# Altium project um3Supply.PrjPcb
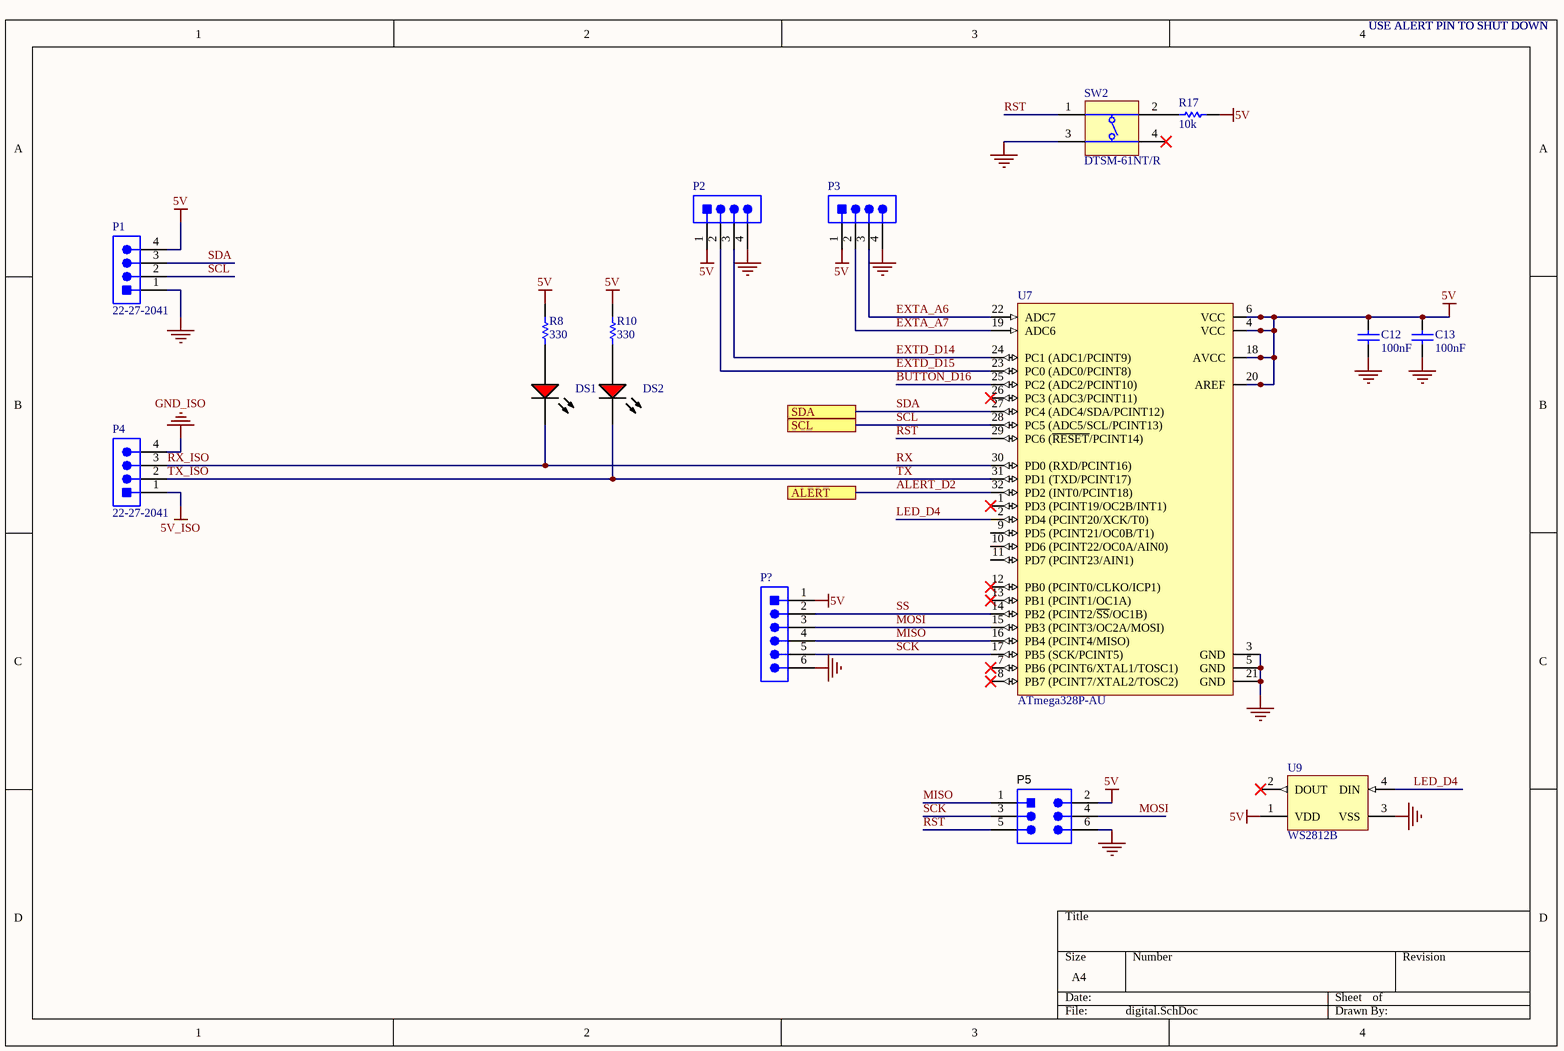
[diagram p0: digital.SchDoc]
2 sheets, 50 parts. Net scope: flat (ports and power ports of the same name join across sheets).
Sheets:
  digital.SchDoc
  um3Supply.SchDoc

## Sheet digital.SchDoc
size A4

### Parts
C12  100nF  [CAPC0805(2012)100_L]
C13  100nF  [CAPC0805(2012)100_L]
DS1  TLMS1100-GS08  [VISH-TLMX1100_V]  (value not drawn)
DS2  TLMS1100-GS08  [VISH-TLMX1100_V]  (value not drawn)
P1  22-27-2041  [MOLX-22-27-2041_V]
P2  22-27-2041  [MOLX-22-27-2041_V]  (value not drawn)
P3  22-27-2041  [MOLX-22-27-2041_V]  (value not drawn)
P4  22-27-2041  [MOLX-22-27-2041_V]
P5  5-146130-2  [TECO-5-146130-2_V]  (value not drawn)
P?  22-23-2061  [MOLX-22-23-2061_V]  (value not drawn)
R8  330  [RESC0805(2012)_L]
R10  330  [RESC0805(2012)_L]
R17  10k  [RESC0805(2012)_L]
SW2  DTSM-61NT/R  [DIPT-DTSM-6_V]
U7  ATmega328P-AU  [32A_M]
U9  WS2812B  [ADAI-WS2812B_V]

### Ports
ALERT, SCL, SDA

### Nets
5V: C12.2 C13.2 P1.4 P2.1 P3.1 P5.2 P?.1 R8.1 R10.1 R17.2 U7.4(VCC) U7.6(VCC) U7.18(AVCC) U7.20(AREF) U9.1(VDD)
5V_ISO: P4.1
GND: C12.1 C13.1 P1.1 P2.4 P3.4 P5.6 P?.6 SW2.3(T3) U7.3(GND) U7.5(GND) U7.21(GND) U9.3(VSS)
GND_ISO: P4.4
ALERT_D2: U7.32(PD2_(INT0/PCINT18)) ; port ALERT
BUTTON_D16: U7.25(PC2_(ADC2/PCINT10))
EXTA_A6: P3.3 U7.22(ADC7)
EXTA_A7: P3.2 U7.19(ADC6)
EXTD_D14: P2.3 U7.24(PC1_(ADC1/PCINT9))
EXTD_D15: P2.2 U7.23(PC0_(ADC0/PCINT8))
LED_D4: U7.2(PD4_(PCINT20/XCK/T0)) U9.4(DIN)
MISO: P5.1 P?.4 U7.16(PB4_(PCINT4/MISO))
MOSI: P5.4 P?.3 U7.15(PB3_(PCINT3/OC2A/MOSI))
RST: P5.5 SW2.1(T1) U7.29(PC6_(~{RESET}/PCINT14))
RX: DS1.2(K) P4.3 U7.30(PD0_(RXD/PCINT16))  [also labelled RX_ISO]
SCK: P5.3 P?.5 U7.17(PB5_(SCK/PCINT5))
SCL: P1.2 U7.28(PC5_(ADC5/SCL/PCINT13)) ; port SCL
SDA: P1.3 U7.27(PC4_(ADC4/SDA/PCINT12)) ; port SDA
SS: P?.2 U7.14(PB2_(PCINT2/~{SS}/OC1B))
TX: DS2.2(K) P4.2 U7.31(PD1_(TXD/PCINT17))  [also labelled TX_ISO]
NetDS1_1: DS1.1(A) R8.2
NetDS2_1: DS2.1(A) R10.2
NetR17_1: R17.1 SW2.2(T2)

Not connected (* = marked no-connect by the designer): SW2 4(T3)*; U7 1(PD3_(PCINT19/OC2B/INT1))* 7(PB6_(PCINT6/XTAL1/TOSC1))* 8(PB7_(PCINT7/XTAL2/TOSC2))* 9(PD5_(PCINT21/OC0B/T1)) 10(PD6_(PCINT22/OC0A/AIN0)) 11(PD7_(PCINT23/AIN1)) 12(PB0_(PCINT0/CLKO/ICP1))* 13(PB1_(PCINT1/OC1A))* 26(PC3_(ADC3/PCINT11))*; U9 2(DOUT)*

### Notes on the sheet
- USE ALERT PIN TO SHUT DOWN

### Library data of the parts
C12 C13 = CMP-1036-04734-1: Tolerance: Â±20%; Case-Metric: 2012; Rated Voltage: 6.3 V; Value: 1uF; Case-EIA: 0805; Max Thickness: 1 mm; Technology: SMT
DS1 DS2 = CMP-1666-00027-1: LED, RED, 2.1 V, -40 to 100 degC, 2-Pin SMD (0603), RoHS, Tape and Reel; Type (Capacitors): C0G; Resistance: 100000000000 Ohm; Capacitance: 12 pF; Voltage Rating: 50 V; Tolerance: 5%; Min Operating Temperature: -55degC; REACH SVHC: No SVHC; ComponentLink2Description: Datasheet; ComponentLink1URL: http://www.vishay.com/; Width: 0.8 mm; Package Quantity: 4000; PackageReference: TLMX1100; ComponentLink2URL: http://www.vishay.com/docs/83173/tlmb1100.pdf; Case/Package: 0603; Case Code (Metric): 1608; Packaging: Tape and Reel; Pins: 2; ComponentLink1Description: Manufacturer URL; Max Operating Temperature: 125degC; Height: 0.8 mm; Length: 1.6 mm; Mount: Surface Mount; PackageDescription: 2-Pin Surface Mount Device, Body 1.6 x 0.8 mm; DatasheetVersion: Rev. 2.7, 03/2016; Case Code (Imperial): 0603; Voltage Rating (DC): 50 V; RoHSCompliant: True; Radiation Hardening: No
P1-P4 = CMP-2000-05243-1: Male Header, Pitch 2.54 mm, 1 x 4 Position, Height 11.7 mm, Tail Length 3.56 mm, RoHS, Bulk; Manufacturer: Molex; Voltage rating: 250V; Current rating: 4A; Datasheet Version: Rev. F, 06/2009; Operating temperature: 0degCto+75degC; Contact material: Tinplatedbrass; Manufacturer URL: http://www.molex.com/; Housing material: Nylon(UL94V-0); Datasheet URL: http://www.molex.com/pdm_docs/sd/022272041_sd.pdf
P5 = CMP-1684-00011-1: Male Header, Pitch 2.54 mm, 2 x 3 Position, Height 8.13 mm, -65 to 125 degC, RoHS, Tube; Max Supply Voltage: 5.5 V; Min Supply Voltage: 4.5 V; Nominal Supply Voltage: 5 V; Min Operating Temperature: -40 degC; ComponentLink1URL: http://www.te.com/; ComponentLink2Description: Datasheet; Pins: 3; Max Operating Temperature: 150 degC; PackageDescription: Male Header, Pitch 2.54 mm, 2 x 3 Position, Height 8.13 mm; Package Quantity: 3000; PackageReference: 5-146130-2; DatasheetVersion: Oct-15; ComponentLink1Description: Manufacturer URL; Radiation Hardening: No; Mount: Surface Mount; RoHSCompliant: true; Packaging: Tape and Reel; ComponentLink2URL: http://www.te.com/commerce/DocumentDelivery/DDEController?Action=showdoc&DocId=Customer+Drawing%7F146130%7FM%7Fpdf%7FEnglish%7FENG_CD_146130_M.pdf%7F5-146130-2
P? = CMP-2000-05536-1: Male Header, Pitch 2.54 mm, 1 x 6 Position, Height 10.67 mm, Tail Length 3.56 mm, 0 to 70 degC, RoHS, Bulk; Manufacturer: Molex; Pitch: 2.54mm; Mounting Angle: Vertical; Current Rating: 4A; Number of Positions / Contacts: 6; Voltage Rating: 250V; Packaging: Bulk; Package Description: Male Header, Pitch 2.54 mm, 1 x 6 Position, Height 10.67 mm, Tail Length 3.56 mm; Number of Rows: 1; Type: PinStrip; Contact Material: Brass; Product Category: .100K.K.Connectors; Factory Pack Quantity: 1000; Mounting Style: ThroughHole; RoHS: Details; Contact Plating: Tin; Housing Material: Nylon; Mounting Technology: ThroughHole; Termination Style: ThroughHole; Tradename: KK; Number of Positions: 6; Brand: Molex; Product Type: Headers; Series: 6373; Datasheet URL: https://datasheet.ciiva.com/19460/232303-19460895.pdf; Package Reference: 22-23-2061; Datasheet Version: Rev. P, 09/2001; Manufacturer URL: http://www.molex.com/
R8 R10 = CMP-1013-00624-1: 10K2 0.125W 1% 0805 (2012 Metric)  SMD; Case-Metric: 2012; Case-EIA: 0805; Value: 10200.00 Ohm; Technology: SMT; Tolerance: 1 %; Power: 0.125 W
R17 = CMP-1013-00397-1: Value: 100.00 Ohm; Power: 0.125 W; Case-Metric: 2012; Case-EIA: 0805; Tolerance: 1 %; Technology: SMT
SW2 = CMP-0306-00001-1: Switch, SPNO Push Button SMD; Manufacturer: Diptronics; Packing Type: Tape&Reel; Mechanical Life: 200,000 cycles; ComponentLink2URL: http://www.dip.com.tw/Products_tact.htm; ComponentLink1URL: http://www.dip.com.tw/; ComponentLink3URL: http://www.dip.com.tw/PDF/pro_tact/DTSM_G_-6_2_-V.pdf; PackageDescription: Switch, Through-Hole, 4 Leads, Body 8.5x8.5mm, Row Spacing 9.0mm, Pitch 4.5mm; ComponentLink2Description: Datasheet; ComponentLink3Description: Package Specification; ComponentLink1Description: Manufacturer URL; PackageReference: DTSM-6; PartNumber: DTSM-61NT/R; Mounting Technology: Through Hole
U7 = CMP-0095-00269-2: 8-bit AVR Microcontroller, 32KB Flash, 1KB EEPROM, 2KB SRAM, 32-pin TQFP, Industrial Grade (-40°C to 85°C); PackageDescription: 32-Lead, 7x7x1.0 mm Body, 0.8mm Lead Pitch, Thin Profile Plastic Quad Flat Package (TQFP); DatasheetVersion: revD, May-2011; RevisionNote: DatasheetVersion & PackageVersion updated. URLs added.; ComponentLink1URL: http://www.atmel.com/; ComponentLink2Description: ATmega48A/48PA/88A/88PA/168A/168PA/328/328P Datasheet; Code_JEDEC: MS-026-ABA; ComponentLink1Description: Manufacturer URL; PackageReference: 32A; ComponentLink3Description: ATmega48A/48PA/88A/88PA/168A/168PA/328/328P Summary; ComponentLink2URL: http://www.atmel.com/dyn/resources/prod_documents/doc8271.pdf; PackageVersion: revC, Oct-2010; ComponentLink3URL: http://www.atmel.com/dyn/resources/prod_documents/8271S.pdf
U9 = CMP-1740-00005-1: Intelligent Control LED Integrated Light Source, 3.5 to 5.3 V, -25 to 80 degC, 4-Pin SMD, RoHS, Bulk; Case\Package: Radial; Shielding: Unshielded; Current Rating: 240 mA; Tolerance: 10%; Mount: Through Hole; Max Operating Temperature: 125 degC; Radiation Hardening: No; Length: 12.2 mm; Min Operating Temperature: -55 degC; ComponentLink1URL: https://www.adafruit.com/; Packaging: Bulk; Lead Pitch: 5 mm; RoHSCompliant: true; Pins: 2; Package Quantity: 200; ComponentLink2URL: https://cdn-shop.adafruit.com/datasheets/WS2812B.pdf; ComponentLink2Description: Datasheet; PackageDescription: 4-Pin Surface Mount Device, Body 5 x 5 mm, Pitch 3.3 mm; PackageReference: WS2812B; Height: 12.2 mm; REACH SVHC: No SVHC; ComponentLink1Description: Manufacturer URL; DatasheetVersion: May-13

## Sheet um3Supply.SchDoc
size A4
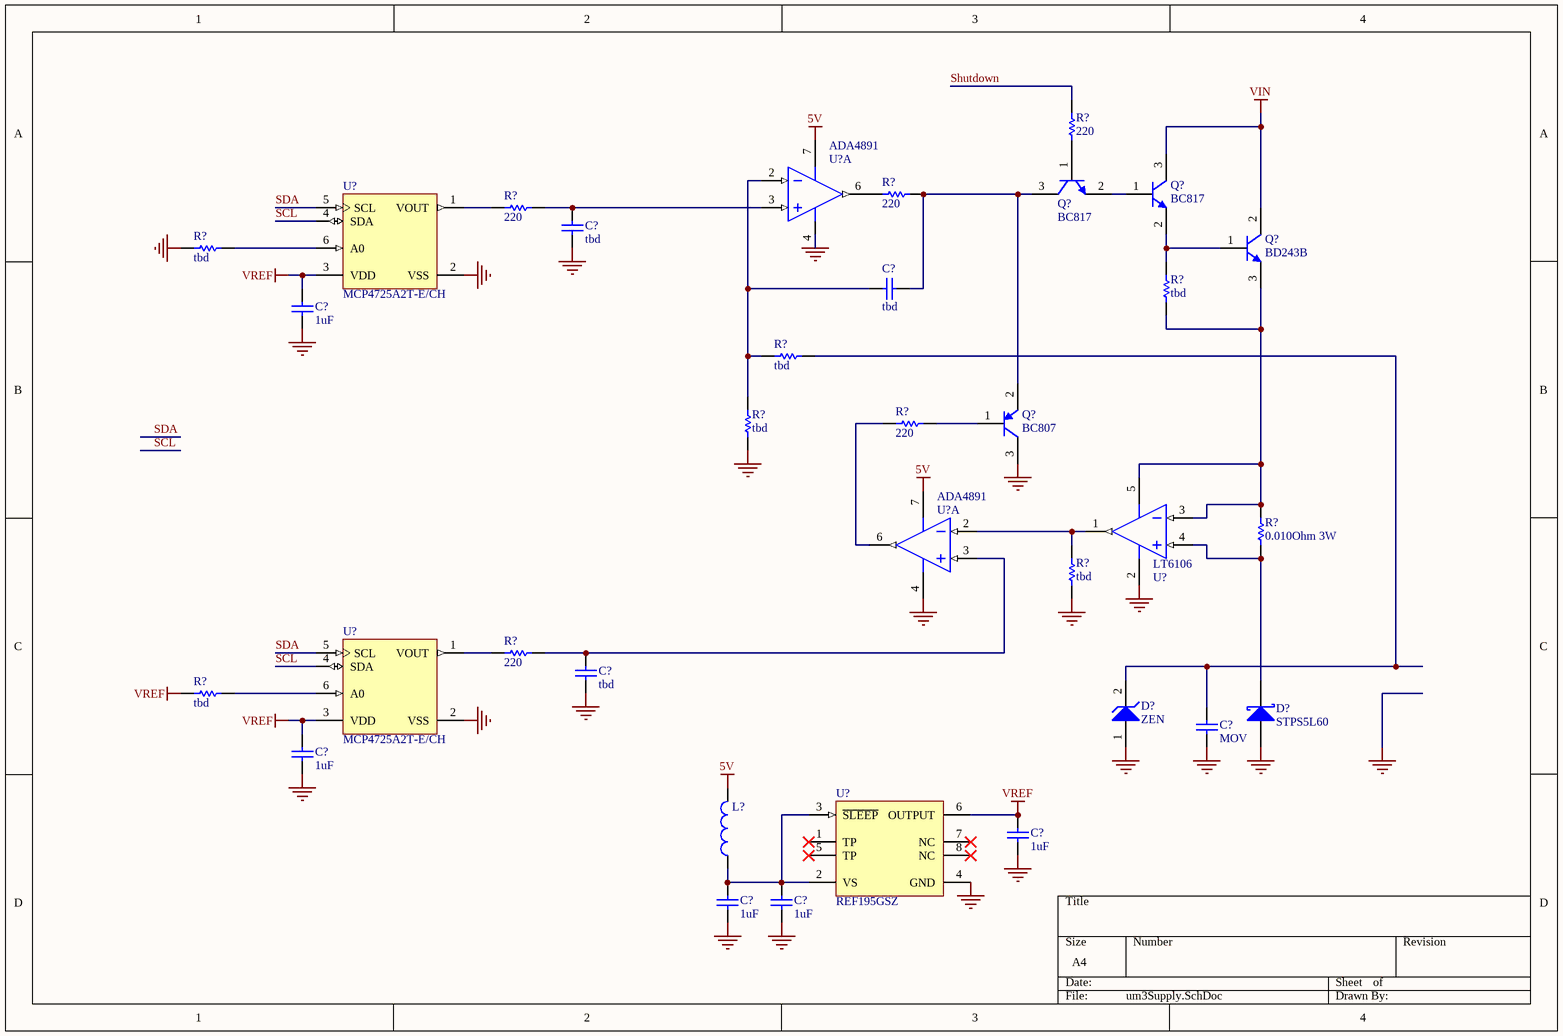
[diagram p1: um3Supply.SchDoc]

### Parts
(Parts that share a designator on the sheet are numbered #1, #2 ... from top to bottom, then left to right.)
C?#1  tbd  [CAPC0805(2012)100_L]
C?#2  tbd  [CAPC0805(2012)100_L]
C?#3  1uF  [CAPC0805(2012)100_L]
C?#4  tbd  [CAPC0805(2012)100_L]
C?#5  MOV  [CAPC2220(5750)230_N]
C?#6  1uF  [CAPC0805(2012)100_L]
C?#7  1uF  [CAPC0805(2012)100_L]
C?#8  1uF  [CAPC0805(2012)100_L]
C?#9  1uF  [CAPC0805(2012)100_L]
D?#1  ZEN  [STM-SMC_V]
D?#2  STPS5L60  [STM-DO-201AD]
L?  FBMJ2125HM210NT  [INDC2013X105X50LL20T30]  (value not drawn)
Q?#1  BC817  [ONSC-SOT-23-3-318-08_V]
Q?#2  BC817  [ONSC-SOT-23-3-318-08_V]
Q?#3  BD243B  [ONSC-TO-220-3-221A-09]
Q?#4  BC807  [ONSC-SC-70-3-419-04_V]
R?#1  220  [RESC0805(2012)_L]
R?#2  220  [RESC0805(2012)_L]
R?#3  220  [RESC0805(2012)_L]
R?#4  tbd  [RESC0805(2012)_L]
R?#5  tbd  [RESC0805(2012)_L]
R?#6  tbd  [RESC0805(2012)_L]
R?#7  tbd  [RESC0805(2012)_L]
R?#8  220  [RESC0805(2012)_L]
R?#9  0.010Ohm 3W  [RESC2512(6432)_M]
R?#10  tbd  [RESC0805(2012)_L]
R?#11  220  [RESC0805(2012)_L]
R?#12  tbd  [RESC0805(2012)_L]
U?#1  ADA4891  [ADI-R-8_L]  (part A of 2)
U?#2  MCP4725A2T-E/CH  [SOT-23-CH6_L]
U?#3  LT6106  [LT-S5-5-TSOT-23_N]
U?#4  ADA4891  [ADI-R-8_L]  (part A of 2)
U?#5  MCP4725A2T-E/CH  [SOT-23-CH6_L]
U?#6  REF195GSZ  [ADI-R-8_N]

### Nets
5V: L?.2 U?#1.7(+VS) U?#4.7(+VS)
GND: C?#1.1 C?#3.1 C?#4.1 C?#5.1 C?#6.1 C?#7.1 C?#8.1 C?#9.1 D?#1.1(A) D?#2.2(A) Q?#4.3(C) R?#4.1 R?#7.2 R?#10.1 U?#1.4(-VS) U?#2.2(VSS) U?#3.2(V-) U?#4.4(-VS) U?#5.2(VSS) U?#6.4(GND)
VIN: Q?#2.3(C) Q?#3.2(C)
VREF: C?#3.2 C?#6.2 C?#7.2 R?#12.1 U?#2.3(VDD) U?#5.3(VDD) U?#6.6(OUTPUT)
SCL: U?#2.4(SDA) U?#5.4(SDA)
SDA: U?#2.5(SCL) U?#5.5(SCL)
Shutdown: R?#1.2
NetC?#1_2: C?#1.2 R?#3.2 U?#1.3(+IN)
NetC?#2_1: C?#2.1 Q?#1.3(C) Q?#4.2(E) R?#2.2
NetC?#2_2: C?#2.2 R?#6.1 R?#7.1 U?#1.2(-IN)
NetC?#4_2: C?#4.2 R?#11.2 U?#4.3(+IN)
NetC?#5_2: C?#5.2 D?#1.2(K) R?#6.2
NetC?#8_2: C?#8.2 C?#9.2 L?.1 U?#6.2(VS) U?#6.3(~{SLEEP})
NetD?#2_1: D?#2.1(K) R?#9.1 U?#3.4(+IN)
NetQ?#1_1: Q?#1.1(B) R?#1.1
NetQ?#1_2: Q?#1.2(E) Q?#2.1(B)
NetQ?#2_2: Q?#2.2(E) Q?#3.1(B) R?#5.2
NetQ?#3_3: Q?#3.3(E) R?#5.1 R?#9.2 U?#3.3(-IN) U?#3.5(V+)
NetQ?#4_1: Q?#4.1(B) R?#8.1
NetR?#2_1: R?#2.1 U?#1.6(OUT)
NetR?#3_1: R?#3.1 U?#2.1(VOUT)
NetR?#4_2: R?#4.2 U?#2.6(A0)
NetR?#8_2: R?#8.2 U?#4.6(OUT)
NetR?#10_2: R?#10.2 U?#3.1(OUT) U?#4.2(-IN)
NetR?#11_1: R?#11.1 U?#5.1(VOUT)
NetR?#12_2: R?#12.2 U?#5.6(A0)

Not connected (* = marked no-connect by the designer): U?#6 1(TP)* 5(TP)* 7(NC)* 8(NC)*

### Library data of the parts
C?#1-C?#4 C?#6-C?#9 = CMP-1036-04734-1: CAP 1uF 6.3V ±20% 0805 (2012 Metric) Thickness 1mm SMD; Tolerance: Â±20%; Case-Metric: 2012; Case-EIA: 0805; Max Thickness: 1 mm; Technology: SMT; Rated Voltage: 6.3 V; Value: 1uF
C?#5 = CMP-1042-00392-1: Value: 22nF; Case-EIA: 2220; Tolerance: Â±20%; Rated Voltage: 200 V; Case-Metric: 5750; Max Thickness: 2.3 mm; Technology: SMT
D?#1 = CMP-0433-00001-1: PartNumber: SMCJ5.0A-TR; Manufacturer: STMicroelectronics; Junction Temperature: -55 to 150 degC; DatasheetVersion: Rev. 8, 07/2010; ComponentLink1URL: http://www.st.com; ComponentLink2Description: Datasheet; Mounting Technology: Surface Mount; PackageReference: SMC; PackageDescription: 2-Pin C-Bend SMT Diode, 7.9 x 5.9 mm Body; ComponentLink2URL: http://www.st.com/st-web-ui/static/active/en/resource/technical/document/datasheet/CD00001367.pdf; ComponentLink1Description: Manufacturer URL
D?#2 = CMP-2000-05365-1: Power Schottky rectifier, 60 V, 5 A, 2-Pin DO-201AD, RoHS, Cut Tape; Manufacturer: STMicroelectronics; Other Related Documents: STPS5L60ViewAllSpecifications; Online Catalog: SchottkyDiode; Current - Average Rectified (Io): 5A; Speed: FastRecovery=200mA(Io); Current - Reverse Leakage @ Vr: 220µA@60V; Other Names: 497-12673-3STPS5L60-ND; Voltage - DC Reverse (Vr) (Max): 60V; Voltage - Forward (Vf) (Max) @ If: 520mV@5A; Package Description: 2-Pin Axial Lead, Dia 5.3 mm, Body Length 9.5 mm; Datasheet Version: Rev. 3, 05/2008; Datasheet URL: http://download.siliconexpert.com/pdfs/2012/8/10/13/5/5/781/st_/manual/cd00002924.pdf; Operating Temperature - Junction: 150degC(Max); Capacitance @ Vr, F: -; Manufacturer URL: http://www.st.com/; Standard Package: 600; Diode Type: Schottky; Package Reference: DO-201AD; Category: DiscreteSemiconductorProducts; Package / Case: DO-201AD,Axial; Family: Diodes,Rectifiers-Single; Packaging: Tape&Box(TB); Supplier Device Package: DO-201AD; Reverse Recovery Time (trr): -; Package URL: http://download.siliconexpert.com/pdfs/2012/8/10/13/5/5/781/st_/manual/cd00002924.pdf; Mounting Type: ThroughHole; Series: -
L? = CMP-1660-00003-1: Chip Inductor, 21 Ohm, +/- 30%, 6 A, -40 to 125 degC, 0805 (2012 Metric), RoHS, Tape and Reel; Core Material: Ferrite; Current Rating: 6 A; Resistance: 4 mohm; Case\Package: 0805; Impedance: 21 Ohm; Min Operating Temperature: -40 degC; Width: 1.25 mm; PackageDescription: 2-Pin Surface Mount Device, Body 2 x 1.25 mm; Mounting Technology: Surface Mount; Package Quantity: 1; DatasheetVersion: 08/2016; Tolerance: 30%; Mount: Surface Mount; Max Operating Temperature: 125 degC; Height: 0.85 mm; ComponentLink1URL: http://www.t-yuden.com/; Case Code (Metric): 2012; ComponentLink1Description: Manufacturer URL; ComponentLink2URL: http://ds.yuden.co.jp/TYCOMPAS/ut/detail.do?productNo=FBMJ2125HM210NT&fileName=FBMJ2125HM210NT_SS&mode=specSheetDownload; Case Code (Imperial): 0805; Packaging: Tape and Reel; ComponentLink2Description: Datasheet; PackageReference: 0805; RoHSCompliant: true; Max Current Rating: 6 A; Length: 2 mm; REACH SVHC: Unknown
Q?#1 Q?#2 = CMP-1048-00736-1: General Purpose Transistor, NPN Silicon, 3-Pin SOT-23, Pb-Free, Tape and Reel; PartNumber: BC817-16LT1G; Manufacturer: On Semiconductor; IC Continuous (A): 0.5; fT Min (MHz): 100; Mounting Technology: Surface Mount; PackageVersion: Rev. AP, 11/2009; ComponentLink3Description: Package Specification; PackageReference: SOT-23-3-318-08; Packing: Tape and Reel; ComponentLink1URL: http://www.onsemi.com/; Polarity: NPN; RoHS: TRUE; ComponentLink2URL: http://www.onsemi.com/pub_link/Collateral/BC817-16LT1-D.PDF; ComponentLink3URL: http://www.onsemi.cn/pub_link/Collateral/318-08.PDF; ComponentLink2Description: Datasheet; PackageDescription: 3-Pin Small Outline Transistor, Body 2.92 x 1.3 mm, Pitch 0.95 mm; ComponentLink1Description: Manufacturer URL; DatasheetVersion: Rev. 12
Q?#3 = CMP-1048-01155-1: Complementary Silicon Plastic Power Transistor, 3-Pin TO-220, Tube; Manufacturer: On Semiconductor; Polarity: NPN; IC Continuous (A): 6; Note1: 0; fT Min (MHz): 3; DatasheetVersion: Rev. 14; PackageReference: TO-220-3-221A-09; RoHS: FALSE; Mounting Technology: Through Hole; PartNumber: BD243B; ComponentLink3URL: http://www.onsemi.com/pub_link/Collateral/221A-09.PDF; ComponentLink1Description: Manufacturer URL; Packing: Tube; PackageVersion: Rev. AG, 09/2011; ComponentLink1URL: http://www.onsemi.com/; ComponentLink3Description: Package Specification; PackageDescription: 3-Pin Flange Mount, Vertical Straight Lead, Body 9.97 x 4.445 mm, Pitch 2.54 mm; ComponentLink2Description: Datasheet; ComponentLink2URL: http://www.onsemi.com/pub_link/Collateral/BD243B-D.PDF
Q?#4 = CMP-1048-00340-1: General Purpose Transistor, PNP Silicon, 3-Pin SC70, Pb-Free, Tape and Reel; PartNumber: BC807-40WT3G; Manufacturer: On Semiconductor; Note1: 0; fT Min (MHz): 100; IC Continuous (A): -0.5; PackageReference: SC-70-3-419-04; RoHS: TRUE; PackageVersion: Rev. N, 11/2008; ComponentLink2Description: Datasheet; DatasheetVersion: Rev. 3; ComponentLink3URL: http://www.onsemi.cn/pub_link/Collateral/419-04.PDF; ComponentLink1URL: http://www.onsemi.com/; ComponentLink1Description: Manufacturer URL; PackageDescription: 3-Pin Small Outline Transistor, Body 2 x 1.25 mm, Pitch 0.65 mm; ComponentLink3Description: Package Specification; Mounting Technology: Surface Mount; Packing: Tape and Reel; Polarity: PNP; ComponentLink2URL: http://www.onsemi.com/pub_link/Collateral/BC807-25W-D.PDF
R?#1-R?#8 R?#10-R?#12 = CMP-1013-00397-1: as R17 on sheet digital; Technology: SMT
R?#9 = CMP-1018-00955-1: Case-EIA: 2512; Case-Metric: 6432; Power: 1 W; Value: 8660000.00 Ohm; Tolerance: 1 %; Technology: SMT
U?#1 U?#4 = CMP-0384-01118-1: ADA4891-1ARZ-R7, Single Channel Single-Supply Operation Operational Amplifier, 240 MHz BW, 170 V/us SR, Industrial, 8-pin SOIC (R-8), Reel; Manufacturer: Analog Devices; Input Bias Current: 2pA; V Span Max: 5.5V; Iq/Amp: 4.4mA; Amplifiers Per Package: 1; Small Signal Bandwidth: 240MHz; Input Offset Voltage: 2.5mV; V Span Min: 2.7V; DatasheetVersion: Rev. D; Packing: Reel; ComponentLink1URL: http://www.analog.com/en/index.html; ComponentLink3Description: Package Specification; Generic Part Number: ADA4891-1; Code_JEDEC: MS-012-AA; Mounting Technology: Surface Mount; PartNumber: ADA4891-1ARZ-R7; PackageDescription: 8-Pin Standard Small Outline Package, Body 3.9 x 4.9 mm, Pitch 1.27 mm; Slew Rate: 170V/us; PackageReference: R-8; ComponentLink1Description: Manufacturer URL; ComponentLink3URL: http://www.analog.com/static/imported-files/packages/PKG_PDF/SOIC_Narrow%20(R)/R_8.pdf; ComponentLink2URL: http://www.analog.com/static/imported-files/data_sheets/ADA4891-1_4891-2_4891-3_4891-4.PDF; PackageVersion: 060506-A; ComponentLink2Description: Datasheet; PartId: 1
U?#2 U?#5 = CMP-0188-00758-2: 12-Bit Digital-to-Analog Converter with EEPROM Memory in SOT-23-6, 6-Pin SOT-23, Extended Temperature, Tape and Reel; PackageDescription: 6-Lead Plastic Small Outline Transistor (CH) [SOT-23]; ComponentLink1URL: http://www.microchip.com/; ComponentLink3URL: http://www.microchip.com/stellent/groups/techpub_sg/documents/packagingspec/en012702.pdf; ComponentLink2Description: Datasheet; PackageReference: SOT-23-CH6; DatasheetVersion: revD, Jun-2009; RevisionNote: URLs added.; Code_IPC: SOT26A-6; ComponentLink2URL: http://ww1.microchip.com/downloads/en/DeviceDoc/22039d.pdf; ComponentLink1Description: Manufacturer URL; ComponentLink3Description: Package Specification; PackageVersion: revBB, Aug-2009
U?#3 = CMP-0359-01871-1: LT6106CS5#TRPBF, Single Channel, Low Cost, High Side Current Sense Operational Amplifier, 0.2 MHz Typical GBW, 5-Pin SOT-23 (S5-5), Commercial, Pb-Free, Reel; Manufacturer: Linear Technology; Vos (mV) Guaranteed: 0.25; GBW (MHz) Typical: 0.2; Channels (#): 1; Is (mA) Typical: 0.06; Vs Min (V): 2.7; Vs Max (V): 36; Vos (mV) Typical: 0.15; Linear Technology Part Number: LT6106; PackageDescription: 5-Lead Plastic TSOT-23, Body 1.63 x 2.90 mm, Pitch 0.95 mm; ComponentLink2URL: http://cds.linear.com/docs/Packaging/SOT_5_05-08-1635.pdf; Mounting Technology: Surface Mount; ComponentLink1Description: Datasheet; ComponentLink1URL: http://cds.linear.com/docs/Datasheet/6106fa.pdf; DatasheetVersion: Rev. A; Packing: Reel; ComponentLink2Description: Package Specification; Code_JEDEC: MO-193; Type: CSA; PackageReference: LT-S5-5-TSOT-23; RoHS: Pb-Free; PartNumber: LT6106CS5#TRPBF
U?#6 = CMP-0784-00123-1: Manufacturer: Analog Devices; Ref Out TC (ppm/C): 10; Vout: 5V; Packing: Tube; ComponentLink1URL: http://www.analog.com/en/index.html; ComponentLink4Description: URL Link1; Mounting Technology: Surface Mount; PartNumber: REF195GSZ; Operating Temp Range: -40 to 85 degC; ComponentLink4URL: Product URL:http://www.analog.com/en/special-linear-functions/voltage-references/ref195/products/product.html; ComponentLink2Description: Datasheet; ComponentLink1Description: Manufacturer URL; DatasheetVersion: Rev. L; Code_JEDEC: MS-012-AA; ComponentLink3URL: http://www.analog.com/static/imported-files/packages/PKG_PDF/SOIC_Narrow%20(R)/R_8.pdf; ComponentLink3Description: Package Specification; PackageVersion: 060506-A, 06/2006; PackageReference: R-8; PackageDescription: 8-Pin Standard Small Outline Package, Body 4.9 x 3.9 mm, Pitch 1.27 mm; ComponentLink2URL: http://www.analog.com/static/imported-files/data_sheets/REF19xSeries.pdf

## Nets that join several sheets
5V: digital (15 pins), um3Supply (L?.2 U?#1.7 U?#4.7)
GND: digital (12 pins), um3Supply (20 pins)